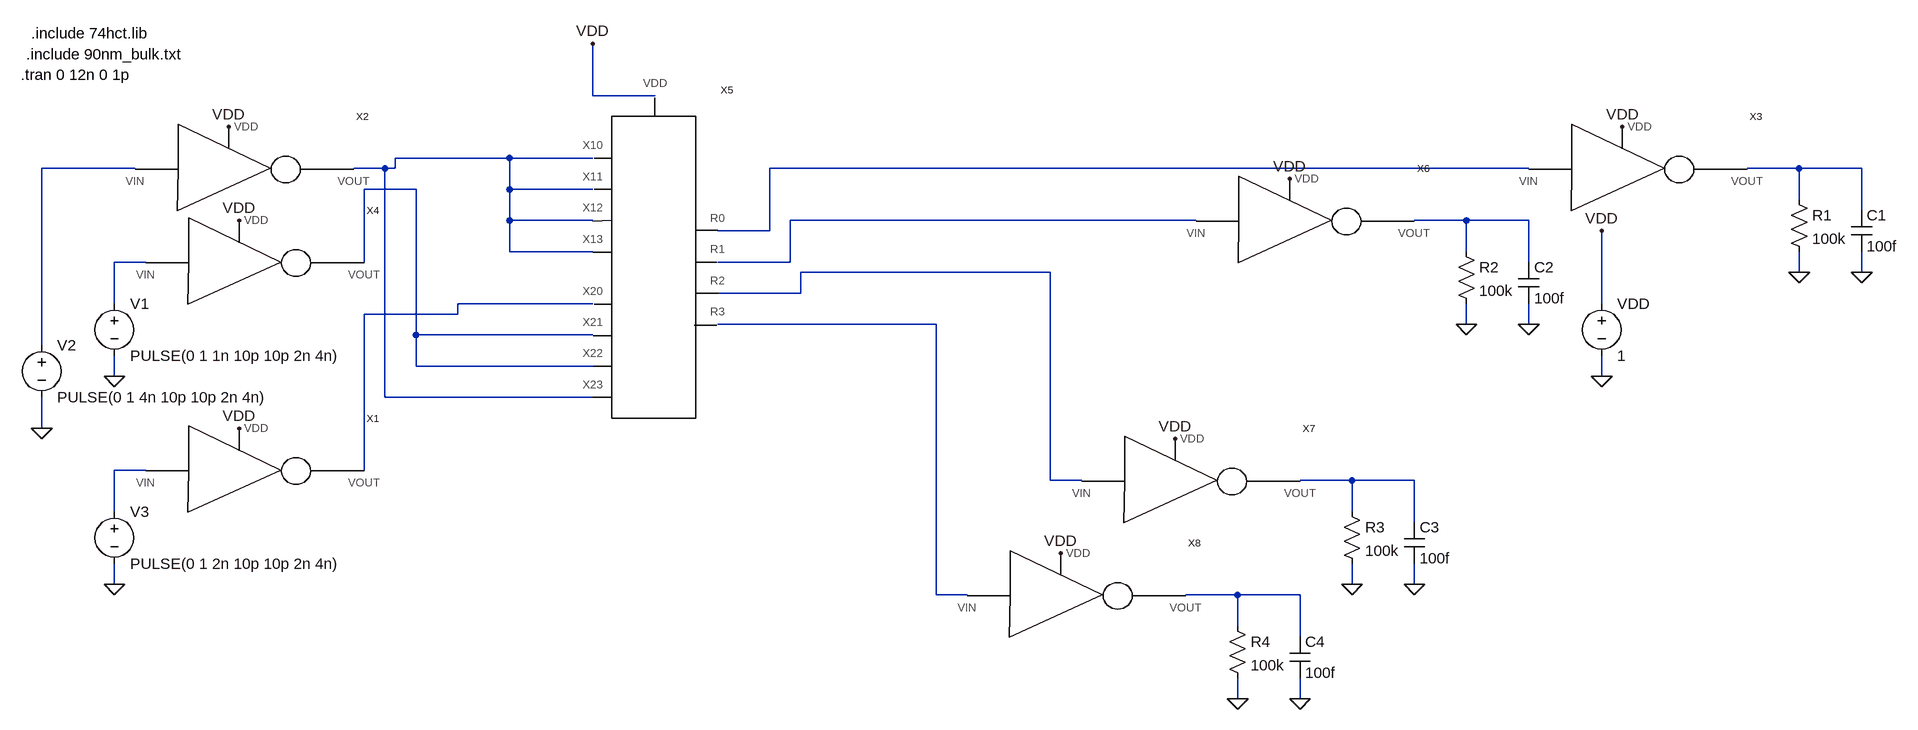
[diagram p0: schematic task_2.3.asc]
task_2.3.asc, the LTspice schematic file:
Version 4
SHEET 1 2012 1524
WIRE 0 480 0 400
WIRE 96 480 0 480
WIRE -128 576 -304 576
WIRE 0 576 -128 576
WIRE -704 592 -848 592
WIRE -320 592 -368 592
WIRE -304 592 -304 576
WIRE -304 592 -320 592
WIRE 1440 592 272 592
WIRE 1856 592 1776 592
WIRE 1952 592 1856 592
WIRE -272 624 -352 624
WIRE -128 624 -128 576
WIRE 0 624 -128 624
WIRE 1856 640 1856 592
WIRE 1952 656 1952 592
WIRE -128 672 -128 624
WIRE 0 672 -128 672
WIRE 928 672 304 672
WIRE 1344 672 1264 672
WIRE 1440 672 1344 672
WIRE 272 688 272 592
WIRE 272 688 192 688
WIRE -128 720 -128 672
WIRE 0 720 -128 720
WIRE 1344 720 1344 672
WIRE -688 736 -736 736
WIRE -352 736 -352 624
WIRE 304 736 304 672
WIRE 304 736 192 736
WIRE 1440 736 1440 672
WIRE 704 752 320 752
WIRE 1856 752 1856 720
WIRE 1952 752 1952 720
WIRE 320 784 320 752
WIRE 320 784 192 784
WIRE -736 800 -736 736
WIRE 0 800 -208 800
WIRE 1552 800 1552 688
WIRE -208 816 -208 800
WIRE -208 816 -352 816
WIRE 528 832 192 832
WIRE 1344 832 1344 800
WIRE 1440 832 1440 800
WIRE -272 848 -272 624
WIRE 0 848 -272 848
WIRE -848 864 -848 592
WIRE -272 896 -272 848
WIRE 0 896 -272 896
WIRE -736 912 -736 880
WIRE 1552 912 1552 880
WIRE -320 944 -320 592
WIRE 0 944 -320 944
WIRE -848 992 -848 944
WIRE -688 1056 -736 1056
WIRE -352 1056 -352 816
WIRE 704 1072 704 752
WIRE 752 1072 704 1072
WIRE 1168 1072 1088 1072
WIRE 1264 1072 1168 1072
WIRE -736 1120 -736 1056
WIRE 1168 1120 1168 1072
WIRE 1264 1136 1264 1072
WIRE -736 1232 -736 1200
WIRE 1168 1232 1168 1200
WIRE 1264 1232 1264 1200
WIRE 528 1248 528 832
WIRE 576 1248 528 1248
WIRE 992 1248 912 1248
WIRE 1088 1248 992 1248
WIRE 992 1296 992 1248
WIRE 1088 1312 1088 1248
WIRE 992 1408 992 1376
WIRE 1088 1408 1088 1376
FLAG 0 400 VDD
FLAG 1552 688 VDD
FLAG 1552 912 0
FLAG -848 992 0
FLAG -736 912 0
FLAG 1856 752 0
FLAG 1952 752 0
FLAG -560 528 VDD
FLAG -544 672 VDD
FLAG 1584 528 VDD
FLAG -736 1232 0
FLAG -544 992 VDD
FLAG 1344 832 0
FLAG 1440 832 0
FLAG 1072 608 VDD
FLAG 1168 1232 0
FLAG 1264 1232 0
FLAG 896 1008 VDD
FLAG 992 1408 0
FLAG 1088 1408 0
FLAG 720 1184 VDD
SYMBOL voltage 1552 784 R0
WINDOW 123 0 0 Left 2
WINDOW 39 0 0 Left 2
SYMATTR InstName VDD
SYMATTR Value 1
SYMBOL voltage -848 848 R0
WINDOW 123 0 0 Left 2
WINDOW 39 0 0 Left 2
SYMATTR InstName V2
SYMATTR Value PULSE(0 1 4n 10p 10p 2n 4n)
SYMBOL voltage -736 784 R0
WINDOW 123 0 0 Left 2
WINDOW 39 0 0 Left 2
SYMATTR InstName V1
SYMATTR Value PULSE(0 1 1n 10p 10p 2n 4n)
SYMBOL res 1840 624 R0
SYMATTR InstName R1
SYMATTR Value 100k
SYMBOL cap 1936 656 R0
SYMATTR InstName C1
SYMATTR Value 100f
SYMBOL inverter -576 592 R0
SYMATTR InstName X2
SYMBOL inverter 1568 592 R0
SYMATTR InstName X3
SYMBOL inverter -560 736 R0
SYMATTR InstName X4
SYMBOL inverter -560 1056 R0
SYMATTR InstName X1
SYMBOL voltage -736 1104 R0
WINDOW 123 0 0 Left 2
WINDOW 39 0 0 Left 2
SYMATTR InstName V3
SYMATTR Value PULSE(0 1 2n 10p 10p 2n 4n)
SYMBOL res 1328 704 R0
SYMATTR InstName R2
SYMATTR Value 100k
SYMBOL cap 1424 736 R0
SYMATTR InstName C2
SYMATTR Value 100f
SYMBOL inverter 1056 672 R0
SYMATTR InstName X6
SYMBOL res 1152 1104 R0
SYMATTR InstName R3
SYMATTR Value 100k
SYMBOL cap 1248 1136 R0
SYMATTR InstName C3
SYMATTR Value 100f
SYMBOL inverter 880 1072 R0
SYMATTR InstName X7
SYMBOL ffg 96 736 R0
SYMATTR InstName X5
SYMBOL res 976 1280 R0
SYMATTR InstName R4
SYMATTR Value 100k
SYMBOL cap 1072 1312 R0
SYMATTR InstName C4
SYMATTR Value 100f
SYMBOL inverter 704 1248 R0
SYMATTR InstName X8
TEXT -880 448 Left 2 !.tran 0 12n 0 1p
TEXT -872 416 Left 2 !.include 90nm_bulk.txt
TEXT -864 384 Left 2 !.include 74hct.lib

The netlist it stands for:
* task_2.3.asc
VDD VDD 0 1
V2 N002 0 PULSE(0 1 4n 10p 10p 2n 4n)
V1 N008 0 PULSE(0 1 1n 10p 10p 2n 4n)
R1 N004 0 100k
C1 N004 0 100f
XX2 N002 N001 VDD inverter  ; pins VIN VOUT VDD
XX3 N003 N004 VDD inverter  ; pins VIN VOUT VDD
XX4 N008 N005 VDD inverter  ; pins VIN VOUT VDD
XX1 N012 N010 VDD inverter  ; pins VIN VOUT VDD
V3 N012 0 PULSE(0 1 2n 10p 10p 2n 4n)
R2 N007 0 100k
C2 N007 0 100f
XX6 N006 N007 VDD inverter  ; pins VIN VOUT VDD
R3 N013 0 100k
C3 N013 0 100f
XX7 N009 N013 VDD inverter  ; pins VIN VOUT VDD
XX5 N001 N001 N001 N001 N010 N005 N005 N001 N003 N006 N009 N011 VDD ffg  ; pins X10 X11 X12 X13 X20 X21 X22 X23 R0 R1 R2 R3 VDD
R4 N014 0 100k
C4 N014 0 100f
XX8 N011 N014 VDD inverter  ; pins VIN VOUT VDD
.tran 0 12n 0 1p
.include 90nm_bulk.txt
.include 74hct.lib
.backanno
.end